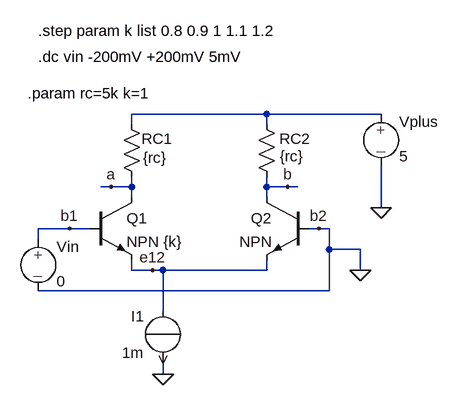
[diagram p0: schematic diff_offset.asc]
diff_offset.asc, the LTspice schematic file:
Version 4
SHEET 1 880 680
WIRE 416 -32 208 -32
WIRE 592 -32 416 -32
WIRE 208 -16 208 -32
WIRE 416 -16 416 -32
WIRE 176 80 160 80
WIRE 208 80 208 64
WIRE 208 80 176 80
WIRE 416 80 416 64
WIRE 448 80 416 80
WIRE 464 80 448 80
WIRE 208 96 208 80
WIRE 416 96 416 80
WIRE 592 112 592 48
WIRE 112 144 64 144
WIRE 144 144 112 144
WIRE 496 144 480 144
WIRE 512 144 496 144
WIRE 64 160 64 144
WIRE 512 176 512 144
WIRE 560 176 512 176
WIRE 208 208 208 192
WIRE 240 208 208 208
WIRE 256 208 240 208
WIRE 416 208 416 192
WIRE 416 208 256 208
WIRE 560 208 560 176
WIRE 512 240 512 176
WIRE 512 240 64 240
WIRE 256 272 256 208
WIRE 256 368 256 352
FLAG 592 112 0
FLAG 256 368 0
FLAG 112 144 b1
FLAG 496 144 b2
FLAG 240 208 e12
FLAG 560 208 0
FLAG 448 80 b
FLAG 176 80 a
SYMBOL source-I 256 352 R180
WINDOW 0 29 73 Left 2
WINDOW 3 29 17 Left 2
SYMATTR InstName I1
SYMATTR Value 1m
SYMBOL EIT_Semiconductors\\npn 144 96 R0
SYMATTR InstName Q1
SYMATTR Value NPN {k}
SYMBOL EIT_Semiconductors\\npn 480 96 M0
SYMATTR InstName Q2
SYMBOL source-V 64 144 R0
SYMATTR InstName Vin
SYMATTR Value 0
SYMBOL source-V 592 -48 R0
SYMATTR InstName Vplus
SYMATTR Value 5
SYMBOL res 192 -32 R0
WINDOW 0 31 38 Left 2
WINDOW 3 33 67 Left 2
SYMATTR InstName RC1
SYMATTR Value {rc}
SYMBOL res 400 -32 R0
WINDOW 0 35 38 Left 2
WINDOW 3 36 65 Left 2
SYMATTR InstName RC2
SYMATTR Value {rc}
TEXT 64 -120 Left 2 !.dc vin -200mV +200mV 5mV
TEXT 48 -64 Left 2 !.param rc=5k k=1
TEXT 64 -160 Left 2 !.step param k list 0.8 0.9 1 1.1 1.2

The netlist it stands for:
* diff_offset.asc
I1 e12 0 1m
Q1 a b1 e12 0 NPN {k}
Q2 b 0 e12 0 NPN
Vin b1 0 0
Vplus N001 0 5
RC1 N001 a {rc}
RC2 N001 b {rc}
.model NPN NPN
.model PNP PNP
.lib standard.bjt
.dc vin -200mV +200mV 5mV
.param rc=5k k=1
.step param k list 0.8 0.9 1 1.1 1.2
.backanno
.end